# EAGLE design controllerHatMini (EAGLE 7.6.0)
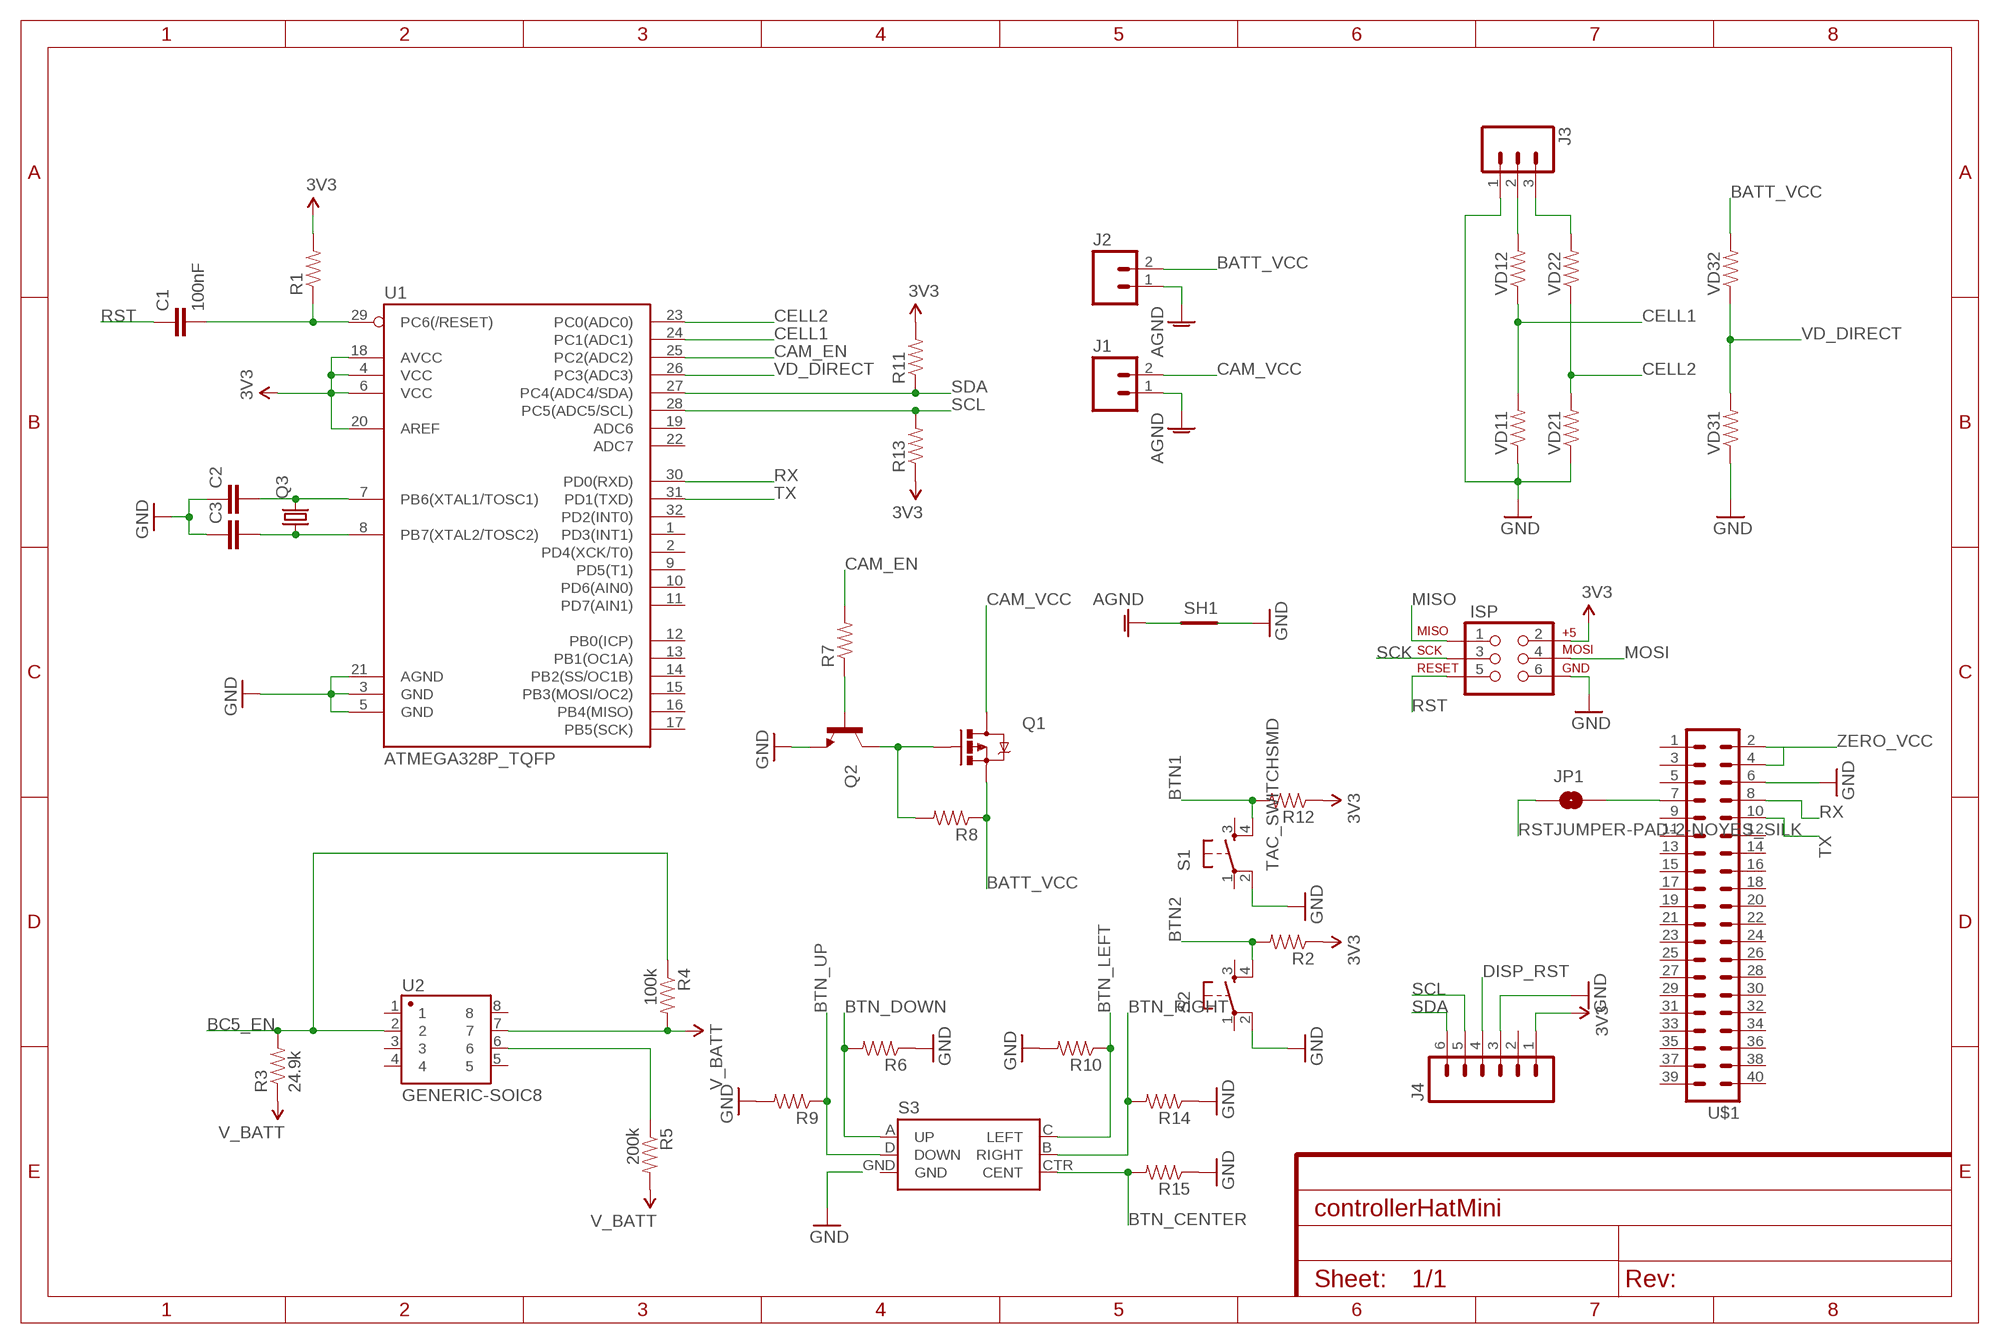
[diagram p0: schematic, sheet 1]

## Parts
C1  100nF  CAP1206  [1206]
C2  CAP1206  [1206]
C3  CAP1206  [1206]
ISP  AVR_SPI_PRG_6PTH  [2X3]
J1  M023.5MM_LOCK  [SCREWTERMINAL-3.5MM-2_LOCK]
J2  M023.5MM_LOCK  [SCREWTERMINAL-3.5MM-2_LOCK]
J3  M03LOCK  [1X03_LOCK]
J4  M06LOCK  [1X06_LOCK]
JP1  JUMPER-PAD-2-NOYES_SILK  [PAD-JUMPER-2-NO_YES_SILK]
Q1  MOSFET-PCHANNELNDP6020P_20V_24A_LOW_VGS_TH  [TO220V]
Q2  TRANSISTOR_NPN2N3904  [TO-92]
Q3  CRYSTALMM20SS  [MM20SS]
R1  RESISTOR1206  [1206]
R2  RESISTOR1206  [1206]
R3  24.9k  RESISTOR1206  [1206]
R4  100k  RESISTOR1206  [1206]
R5  200k  RESISTOR1206  [1206]
R6  RESISTOR1206  [1206]
R7  RESISTOR1206  [1206]
R8  RESISTOR1206  [1206]
R9  RESISTOR1206  [1206]
R10  RESISTOR1206  [1206]
R11  RESISTOR1206  [1206]
R12  RESISTOR1206  [1206]
R13  RESISTOR1206  [1206]
R14  RESISTOR1206  [1206]
R15  RESISTOR1206  [1206]
S1  TAC_SWITCHSMD  TAC_SWITCHPTH  [TACTILE-PTH]
S2  TAC_SWITCHPTH  [TACTILE-PTH]
S3  JOYSTICK_MINI  [JOYSTICK_MINI]
SH1  SHORT-HT5  [SHORT_TOP-50]
U1  ATMEGA328P_TQFP  [TQFP32-08]
U2  GENERIC-SOIC8  [SO08-UNIVERSAL]
U$1  PIZERO_THROUGH_HOLE  [PIZERO_THOUGH_HOLE]
VD11  RESISTOR1206  [1206]
VD12  RESISTOR1206  [1206]
VD21  RESISTOR1206  [1206]
VD22  RESISTOR1206  [1206]
VD31  RESISTOR1206  [1206]
VD32  RESISTOR1206  [1206]

## Nets
AGND [power]: J1.1 J2.1 SH1.1
BATT_VCC [power]: J2.2 Q1.3(S) R8.1 VD32.2
BC5_EN: R3.2 R4.1 U2.2
BTN1: R12.2 S1.4
BTN2: R2.2 S2.4
BTN_CENTER: R15.2 S3.CTR(CENT)
BTN_DOWN: R6.2 S3.A(UP)
BTN_LEFT: R10.1 S3.C(LEFT)
BTN_RIGHT: R14.2 S3.B(RIGHT)
BTN_UP: R9.1 S3.D(DOWN)
CAM_EN: R7.2 U1.25(PC2(ADC2))
CAM_VCC [power]: J1.2 Q1.2(D)
CELL1: U1.24(PC1(ADC1)) VD11.2 VD12.1
CELL2: U1.23(PC0(ADC0)) VD21.2 VD22.1
DISP_RST [power]: J4.4
GND: C2.1 C3.1 ISP.6 J3.1 J4.3 Q2.1(E) R6.1 R9.2 R10.2 R14.1 R15.1 S1.2 S2.2 SH1.2 U1.3(GND) U1.5(GND) U1.21(AGND) U$1.6 VD11.1 VD21.1 VD31.1
MISO: ISP.1
MOSI: ISP.4
N$1: J3.3 VD22.2
N$2: J3.2 VD12.2
N$3: C1.2 R1.1 U1.29(PC6(/RESET))
N$4: U$1.4
N$5: Q2.2(B) R7.1
N$6: C3.2 Q3.1 U1.8(PB7(XTAL2/TOSC2))
N$7: C2.2 Q3.4 U1.7(PB6(XTAL1/TOSC1))
N$8: JP1.2 U$1.7
N$9: Q1.1(G) Q2.3(C) R8.2
N$11: R5.1 U2.6
RST: C1.1 ISP.5 JP1.1
RX: U1.30(PD0(RXD)) U$1.8
SCK: ISP.3
SCL: J4.5 R13.2 U1.28(PC5(ADC5/SCL))
SDA: J4.6 R11.1 U1.27(PC4(ADC4/SDA))
TX: U1.31(PD1(TXD)) U$1.10
V_BATT: R3.1 R4.2 R5.2 U2.7
VCC: ISP.2 J4.1 R1.2 R2.1 R11.2 R12.1 R13.1 U1.4(VCC) U1.6(VCC) U1.18(AVCC) U1.20(AREF) ; supply symbol labelled 3V3
VD_DIRECT: U1.26(PC3(ADC3)) VD31.2 VD32.1
ZERO_VCC: U$1.2
Unconnected: J4.2 S1.1 S1.3 S2.1 S2.3 S3.GND U1.1(PD3(INT1)) U1.2(PD4(XCK/T0)) U1.9(PD5(T1)) U1.10(PD6(AIN0)) U1.11(PD7(AIN1)) U1.12(PB0(ICP)) U1.13(PB1(OC1A)) U1.14(PB2(SS/OC1B)) U1.15(PB3(MOSI/OC2)) U1.16(PB4(MISO)) U1.17(PB5(SCK)) U1.19(ADC6) U1.22(ADC7) U1.32(PD2(INT0)) U2.1 U2.3 U2.4 U2.5 U2.8 U$1.1 U$1.3 U$1.5 U$1.9 U$1.11 U$1.12 U$1.13 U$1.14 U$1.15 U$1.16 U$1.17 U$1.18 U$1.19 U$1.20 U$1.21 U$1.22 U$1.23 U$1.24 U$1.25 U$1.26 U$1.27 U$1.28 U$1.29 U$1.30 U$1.31 U$1.32 U$1.33 U$1.34 U$1.35 U$1.36 U$1.37 U$1.38 U$1.39 U$1.40

## Library data of the parts
C1-C3 = SparkFun-Capacitors:CAP: Capacitor Standard 0603 ceramic capacitor, and 0.1" leaded capacitor.
ISP = SparkFun-Connectors:AVR_SPI_PRG_6: AVR ISP 6 Pin This is the reduced ISP connector for AVR programming. Common on Arduino. This footprint will take up less PCB space and can be used with a 10-pin to 6-pin adapter such as SKU: BOB-08508 **Special note about "TEST_POINT" package. The stop mask is on the top side, so if you want your programming test points to be on the bottom of your board, make sure to place this package on the bottom side of the board. This also ensure that the orientation to program from the bottom side will be correct.
J1 J2 = SparkFun-Connectors:M02: Standard 2-pin 0.1" header. Use with - straight break away headers ( PRT-00116) - right angle break away headers (PRT-00553) - swiss pins (PRT-00743) - machine pins (PRT-00117) - female headers (PRT-00115) Molex polarized connector foot print use with: PRT-08233 with associated crimp pins and housings. 2.54_SCREWTERM for use with PRT-10571. 3.5mm Screw Terminal footprints for PRT-08084 5mm Screw Terminal footprints for use with PRT-08432; PROD_ID: CONN-08399
J3 = SparkFun-Connectors:M03: Header 3 Standard 3-pin 0.1" header. Use with straight break away headers (SKU : PRT-00116), right angle break away headers (PRT-00553), swiss pins (PRT-00743), machine pins (PRT-00117), and female headers (PRT-00115). Molex polarized connector foot print use with SKU : PRT-08232 with associated crimp pins and housings.
J4 = SparkFun-Connectors:M06: Header 6 Standard 6-pin 0.1" header. Use with straight break away headers (SKU : PRT-00116), right angle break away headers (PRT-00553), swiss pins (PRT-00743), machine pins (PRT-00117), and female headers (PRT-00115). Molex polarized connector foot print use with SKU : PRT-08094 with associated crimp pins and housings. NOTES ON THE VARIANTS LOCK and LOCK_LONGPADS... This footprint was designed to help hold the alignment of a through-hole component (i.e. 6-pin header) while soldering it into place. You may notice that each hole has been shifted either up or down by 0.005 of an inch from it's more standard position (which is a perfectly straight line). This slight alteration caused the pins (the squares in the middle) to touch the edges of the holes. Because they are alternating, it causes a "brace" to hold the component in place. 0.005 has proven to be the perfect amount of "off-center" position when using our standard breakaway headers. Although looks a little odd when you look at the bare footprint, once you have a header in there, the alteration is very hard to notice. Also,if you push a header all the way into place, it is covered up entirely on the bottom side. This idea of altering the position of holes to aid alignment will be further integrated into the Sparkfun Library for other footprints. It can help hold any component with 3 or more connection pins.
JP1 = SparkFun-Passives:JUMPER-PAD-2-NO
Q1 = SparkFun-DiscreteSemi:MOSFET-PCHANNEL: Generic PMOSFET IRLML2244 - TRANS-11153 (SOT-23 -20V -4.3A) (1.Gate 2.Source 3.Drain) FQP27P06 - COM-10349 <http://www.sparkfun.com/products/10349> (TO-220 -60V -27A) (1.Gate 2.Source 3.Drain); PROD_ID: TRANS-13060
Q2 = SparkFun-DiscreteSemi:TRANSISTOR_NPN: Generic NPN BJT MMBT2222A - TRANS-08049 (SOT-23, 1A 40V) MPSA42 - TRANS-09116 (SOT-23, 500mA 300V) MMBT5088LT1G - TRANS-11160 (SOT-23, 50 mA 30V) BC547 - COM-08928 <http://www.sparkfun.com/products/8928> (TO-92 45V 100mA) (1.Collector 2.Base 3.Emitter) 2N3904 - COM-00521 <http://www.sparkfun.com/products/521> (TO-92 40V 200mA) (1.Emitter 2.Base 3.Collector) P2N2222A - COM-12852 <http://www.sparkfun.com/products/12852> (TO-92 40V 600mA) (1.Collector 2.Base 3.Emitter); PROD_ID: TRANS-08447
Q3 = adafruit:CRYSTAL: CRYSTAL; OC_FARNELL: unknown; OC_NEWARK: unknown
R1-R15 VD11 VD12 VD21 VD22 VD31 VD32 = SparkFun-Passives:RESISTOR: Resistor Basic schematic elements and footprints for 0603, 1206, and PTH resistors.
S1 S2 = SparkFun-Retired:TAC_SWITCH: Momentary Switch Button commonly used for reset or general input. Spark Fun Electronics SKU : COM-00097 SMT- SWCH-08247
S3 = SparkFun-Electromechanical:JOYSTICK_MINI: Small 5-way tactile joystick, COM-10063 4UCON SF303GJ26; PROD_ID: SWCH-09905
SH1 = shorts-old:SHORT-H: Short between two nets; BOM: no
U1 = SparkFun-DigitalIC:ATMEGA328P_TQFP; PROD_ID: IC-09069
U2 = SparkFun-AnalogIC:GENERIC-SOIC8: A placeholder for generic narrow & wide SOIC8 foorptints - used on the DIP adapter board.
U$1 = pizero:PIZERO_THROUGH_HOLE

## Net classes
1 power: width 0.762 mm

## Board
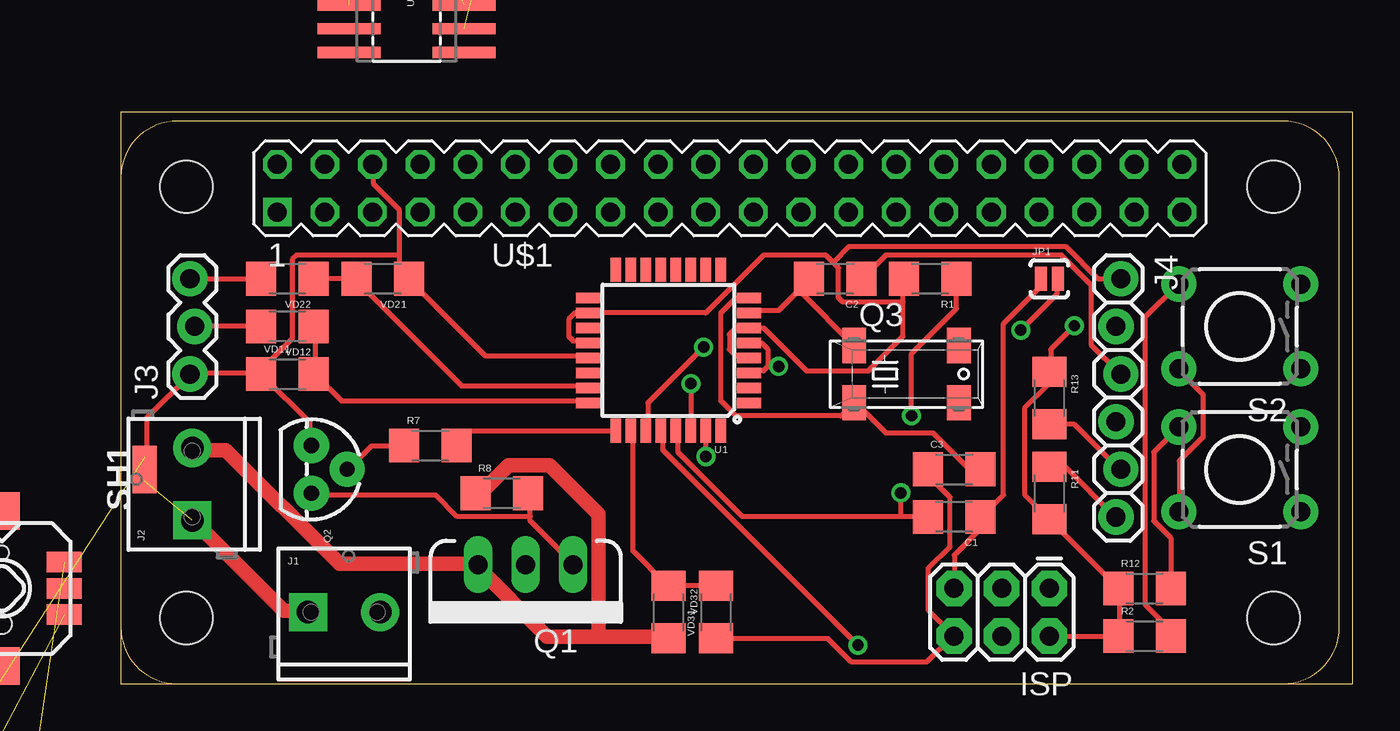
[diagram p1: board, top side]
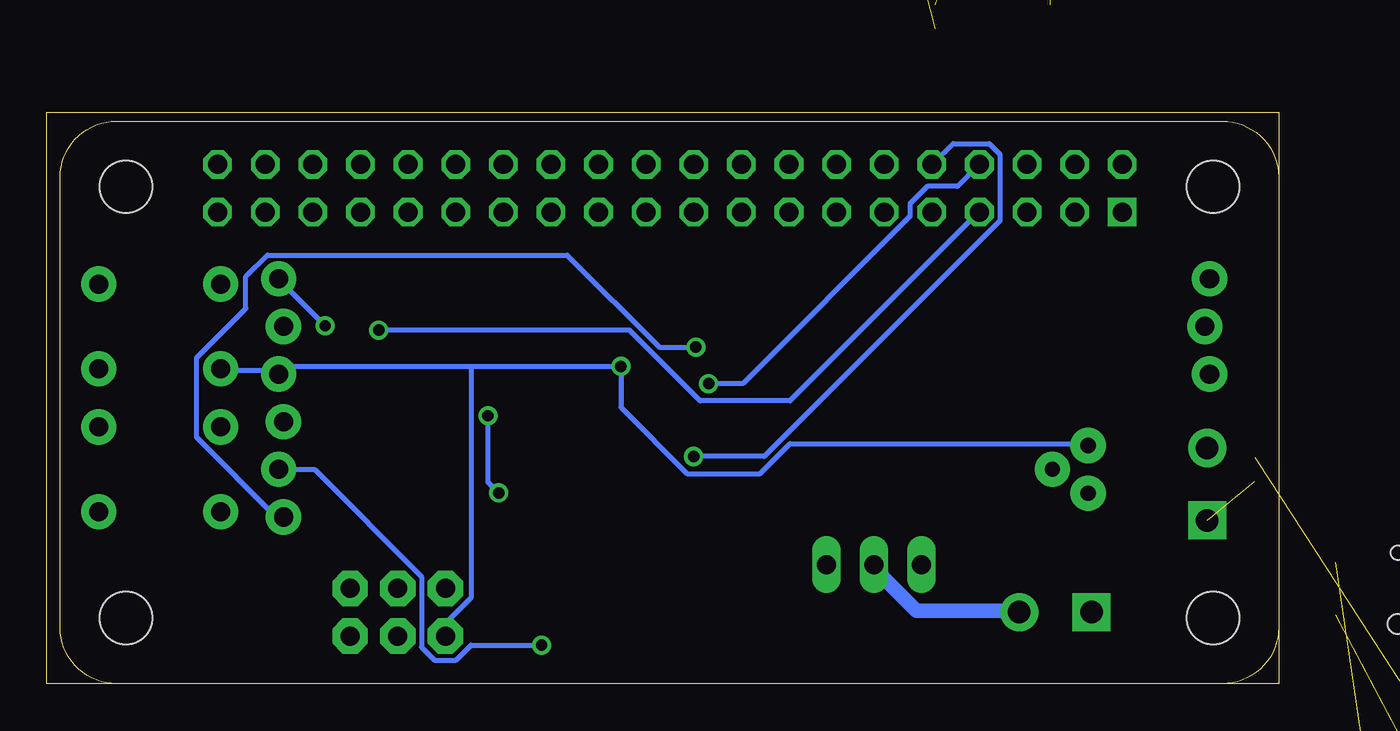
[diagram p2: board, bottom side, seen from below]

Size 65.71 x 30.47 mm. Coordinates in mm from the lower left corner, seen from the top.
Outline: 0,0 65.71,0 65.71,30.47 0,30.47 0,0
Copper layers (1*16): Top 0.035mm / dielectric 1.5mm / Bottom 0.035mm
Design rules "default": minimum track width 10mil, minimum drill 24mil, track to track 8mil, track to pad 8mil, pad to pad 8mil, via to via 8mil, smd to smd 8mil, copper to edge 40mil, drill to drill 8mil, minimum pad ring 10mil, minimum via ring 8mil, stop-mask expansion 4mil, vias tented up to drill 0mil, thermal gap 10mil

### Footprints (pad centres in the part's own frame; a part is rotated, then mirrored left to right if it is on the bottom)
1206 = smd 1.6 x 1.8: 1 -1.4,0; 2 1.4,0
2X3 = drill 1.016 pad 1.88 octagon: 1 0,0; 2 0,2.54; 3 2.54,0; 4 2.54,2.54; 5 5.08,0; 6 5.08,2.54
SCREWTERMINAL-3.5MM-2_LOCK = drill 1.2 pad 2.032 square: 1 -0.178,0 | drill 1.2 pad 2.032: 2 3.678,0
1X03_LOCK = drill 1.016 pad 1.88: 1 0,0.127; 2 2.54,-0.127; 3 5.08,0.127
1X06_LOCK = drill 1.016 pad 1.88: 1 0,0; 2 2.54,-0.254; 3 5.08,0; 4 7.62,-0.254; 5 10.16,0; 6 12.7,-0.254
PAD-JUMPER-2-NO_YES_SILK = smd 0.635 x 1.27: 1 -0.45,0; 2 0.45,0
TO220V = drill 1.016 long: 1 -2.54,0; 2 0,0; 3 2.54,0
TO-92 = drill 0.813 pad 1.88: 1 -1.27,0; 2 0,1.905; 3 1.27,0
MM20SS = smd 1.27 x 1.88: 1 -2.794,-1.524; 2 2.794,-1.524; 3 2.794,1.524; 4 -2.794,1.524
TACTILE-PTH = drill 1.016 pad 1.88: 1 -3.251,2.261; 2 3.251,2.261; 3 -3.251,-2.261; 4 3.251,-2.261
JOYSTICK_MINI = smd 1.85 x 1.1: A -3.325,1.4; B 3.325,1.4; C -3.325,-1.4; CTR -3.325,0; D 3.325,-1.4; GND 3.325,0 | smd 1.9 x 2: NC 0,4.13; NC@0 0,-4.13 | hole 0.75: 0,1.9 | hole 1.05: 0,-1.9
SHORT_TOP-50 = smd 1.27 x 1.27: 1 0.635,0; 2 -0.635,0
TQFP32-08 = smd 1.27 x 0.559: 1 -4.293,2.8; 2 -4.293,2; 3 -4.293,1.2; 4 -4.293,0.4; 5 -4.293,-0.4; 6 -4.293,-1.2; 7 -4.293,-2; 8 -4.293,-2.8; 17 4.293,-2.8; 18 4.293,-2; 19 4.293,-1.2; 20 4.293,-0.4; 21 4.293,0.4; 22 4.293,1.2; 23 4.293,2; 24 4.293,2.8 | smd 0.559 x 1.27: 9 -2.8,-4.293; 10 -2,-4.293; 11 -1.2,-4.293; 12 -0.4,-4.293; 13 0.4,-4.293; 14 1.2,-4.293; 15 2,-4.293; 16 2.8,-4.293; 25 2.8,4.293; 26 2,4.293; 27 1.2,4.293; 28 0.4,4.293; 29 -0.4,4.293; 30 -1.2,4.293; 31 -2,4.293; 32 -2.8,4.293
SO08-UNIVERSAL = smd 0.61 x 3.353: 1 -1.905,-3.073; 2 -0.635,-3.073; 3 0.635,-3.073; 4 1.905,-3.073; 5 1.905,3.073; 6 0.635,3.073; 7 -0.635,3.073; 8 -1.905,3.073
PIZERO_THOUGH_HOLE = drill 1.016 square: 1 8.34,25.15 | drill 1.016 octagon: 2 8.34,27.69; 3 10.88,25.15; 4 10.88,27.69; 5 13.42,25.15; 6 13.42,27.69; 7 15.96,25.15; 8 15.96,27.69; 9 18.5,25.15; 10 18.5,27.69; 11 21.04,25.15; 12 21.04,27.69; 13 23.58,25.15; 14 23.58,27.69; 15 26.12,25.15; 16 26.12,27.69; 17 28.66,25.15; 18 28.66,27.69; 19 31.2,25.15; 20 31.2,27.69; 21 33.74,25.15; 22 33.74,27.69; 23 36.28,25.15; 24 36.28,27.69; 25 38.82,25.15; 26 38.82,27.69; 27 41.36,25.15; 28 41.36,27.69; 29 43.9,25.15; 30 43.9,27.69; 31 46.44,25.15; 32 46.44,27.69; 33 48.98,25.15; 34 48.98,27.69; 35 51.52,25.15; 36 51.52,27.69; 37 54.06,25.15; 38 54.06,27.69; 39 56.6,25.15; 40 56.6,27.69 | hole 2.8: 3.5,3.5; 3.5,26.5; 61.5,26.5; 61.5,3.5

### Placement (x,y rotation side)
C1  44.45,8.89 180 top
C2  38.1,21.59 180 top
C3  44.45,11.43 0 top
ISP  49.53,5.08 180 top
J1  10.16,3.81 0 top
J2  3.81,8.89 90 top
J3  3.81,16.51 90 top
J4  53.34,21.59 270 top
JP1  49.53,21.59 0 top
Q1  21.59,6.35 180 top
Q2  10.16,11.43 270 top
Q3  41.91,16.51 0 top
R1  43.18,21.59 180 top
R2  54.61,2.54 0 top
R3  13.97,44.45 180 top  (outside the outline)
R4  13.97,48.26 0 top  (outside the outline)
R5  20.32,48.26 180 top  (outside the outline)
R6  -7.62,-3.81 0 top  (outside the outline)
R7  16.51,12.7 0 top
R8  20.32,10.16 0 top
R9  -7.62,-7.62 0 top  (outside the outline)
R10  -7.62,-11.43 0 top  (outside the outline)
R11  49.53,10.16 270 top
R12  54.61,5.08 0 top
R13  49.53,15.24 270 top
R14  -7.62,-15.24 0 top  (outside the outline)
R15  -7.62,-19.05 0 top  (outside the outline)
S1  59.69,11.43 180 top
S2  59.69,19.05 180 top
S3  -6.35,5.08 0 top  (outside the outline)
SH1  1.27,11.43 270 top
U1  29.21,17.78 180 top
U2  15.24,35.56 270 top  (outside the outline)
U$1  0,0 0 top
VD11  8.89,16.51 0 top
VD12  8.89,19.05 180 top
VD21  13.97,21.59 180 top
VD22  8.89,21.59 180 top
VD31  31.75,3.81 90 top
VD32  29.21,3.81 270 top

### Tracks (layer width: path | path; a pad name or v marks a point on that pad's centre or on a via)
AGND  (1 unrouted)
  Top 0.762: J1.1 9.94,3.89 8.69,3.89 3.89,8.69 J2.1
BATT_VCC
  Top 0.762: 25.49,2.52 22.75,2.52 18.97,6.29 Q1.3 18.63,6.4 11.66,6.4 5.6,12.46 3.89,12.46 J2.2 | 25.49,2.52 29.15,2.52 VD32.2 | 25.49,2.52 25.49,9.03 22.86,11.66 20.69,11.66 19.2,10.17 18.97,10.17 R8.1
BC5_EN  (2 unrouted)
BTN1
  Top 0.254: S1.4 55.09,12.34 55.09,8.69 56.01,7.77 56.01,5.14 R12.2
BTN2
  Top 0.254: R2.2 56.01,2.63 56.01,2.86 54.63,4.23 54.63,19.55 56.35,21.26 S2.4
BTN_CENTER  (1 unrouted)
BTN_DOWN  (1 unrouted)
BTN_LEFT  (1 unrouted)
BTN_RIGHT  (1 unrouted)
BTN_UP  (1 unrouted)
CAM_EN
  Top 0.254: U1.25 18.63,13.49 17.95,12.8 R7.2
CAM_VCC
  Bottom 0.762: Q1.2 21.49,6.29 21.49,6.06 19.32,3.89 13.95,3.89 J1.2
CELL1
  Top 0.254: U1.24 24.92,15.09 11.77,15.09 10.4,16.46 VD11.2 10.4,16.57 10.4,18.97 VD12.1
CELL2
  Top 0.254: U1.23 24.92,15.89 18.17,15.89 12.57,21.49 VD21.2 12.46,21.6 10.4,21.6 VD22.1
GND  (via drill 0.61)  (5 unrouted)
  Top 0.254: SH1.2 1.37,12.12 1.37,14.17 3.66,16.46 J3.1 3.77,16.57 7.43,16.57 VD11.1 | Q2.1 10.06,12.8 10.06,13.95 7.54,16.46 VD11.1 | U1.21 24.92,17.49 19.43,17.49 15.43,21.49 VD21.1 15.32,21.6 14.86,22.06 14.86,22.86 | 14.86,22.86 14.86,25.26 13.49,26.63 13.49,27.66 U$1.6 | 14.86,22.86 9.37,22.86 9.14,22.63 9.14,18.4 7.43,16.69 VD11.1 | VD31.1 31.77,2.4 37.72,2.4 38.98,1.14 42.98,1.14 44.35,2.52 ISP.6 44.35,2.63 43.09,3.89 43.09,6.17 44.23,7.32 44.23,9.94 43.09,11.09 43.09,11.43 C3.1 | S1.2 56.46,9.26 56.46,11.89 57.72,13.14 57.72,15.43 56.46,16.69 S2.2 | 34.52,16.92 34.29,16.69 33.6,16.69 U1.3 | 34.52,16.92 34.52,17.83 34.18,18.17 33.6,18.17 U1.5 | C2.1 39.55,21.6 40.8,22.86 50.18,22.86 51.78,21.26 51.78,18.06 53.26,16.57 J4.3 | v35.09,16.92 34.52,16.92
  Bottom 0.254: 43.09,16.92 52.92,16.92 53.26,16.57 J4.3 53.26,16.69 56.35,16.69 S2.2 | 43.09,16.92 v35.09,16.92 35.09,14.74 31.55,11.2 27.66,11.2 26.06,12.8 10.17,12.8 Q2.1 | 43.09,16.92 43.09,4.57 44.35,3.31 44.35,2.63 ISP.6
N$1
  Top 0.254: VD22.2 7.43,21.6 3.77,21.6 J3.3
N$2
  Top 0.254: VD12.2 7.43,19.09 4,19.09 J3.2
N$3  (via drill 0.61)
  Top 0.254: 41.6,8.91 42.98,8.91 C1.2 | 41.6,8.91 33.15,8.91 29.72,12.34 29.72,13.49 U1.29 | v42.18,14.29 42.18,17.6 44.58,20 44.58,21.49 R1.1 | 41.6,8.91 v41.6,10.17
  Bottom 0.254: v42.18,14.29 42.18,10.74 v41.6,10.17
N$5
  Top 0.254: R7.1 15.09,12.69 13.37,12.69 12.12,11.43 Q2.2
N$6
  Top 0.254: U1.8 32.8,20.57 32,19.77 32,15.09 32.8,14.29 38.41,14.29 39.09,14.97 Q3.1 39.2,14.97 40.8,13.37 43.32,13.37 45.26,11.43 C3.2
N$7
  Top 0.254: U1.7 33.6,19.89 35.09,19.89 36.69,21.49 C2.2 36.23,20.92 Q3.4
N$8  (via drill 0.61)
  Top 0.254: v48.01,18.86 49.95,20.8 49.95,21.49 JP1.2
  Bottom 0.254: v48.01,18.86 34.63,18.86 30.86,15.09 26.06,15.09 16,25.15 U$1.7
N$9
  Top 0.254: 21.83,8.91 21.83,8.69 24.12,6.4 Q1.1 | 21.83,8.91 21.83,10.06 R8.2 | 21.83,8.91 17.95,8.91 16.8,10.06 10.17,10.06 Q2.3
N$11  (1 unrouted)
RST
  Top 0.254: JP1.1 49.03,21.49 49.03,21.14 47.09,19.2 47.09,10.06 45.95,8.91 C1.1 45.83,8.8 45.83,8.23 44.46,6.86 44.46,5.14 ISP.5
RX  (via drill 0.61)
  Top 0.254: v30.4,16 U1.30
  Bottom 0.254: v30.4,16 28.57,16 19.66,24.92 19.66,25.6 18.75,26.52 17.14,26.52 16,27.66 U$1.8
SCL  (via drill 0.61)
  Top 0.254: v39.32,2.06 28.92,12.46 28.92,13.49 U1.28 | R13.2 49.61,13.83 50.86,13.83 53.26,11.43 J4.5
  Bottom 0.254: v39.32,2.06 43.09,2.06 43.89,1.26 45.03,1.26 45.72,1.94 45.72,5.71 51.44,11.43 J4.5
SDA  (via drill 0.61)
  Top 0.254: v31.09,17.95 28.12,14.97 28.12,13.49 U1.27 | R11.1 49.61,11.54 50.41,11.54 53.03,8.91 J4.6
  Bottom 0.254: v31.09,17.95 33.03,17.95 37.95,22.86 53.95,22.86 55.09,21.72 55.09,20 57.72,17.37 57.72,13.14 53.49,8.91 53.15,8.91 J4.6
TX  (via drill 0.61)
  Top 0.254: v31.2,12.12 U1.31
  Bottom 0.254: v31.2,12.12 27.43,12.12 14.86,24.69 14.86,28.23 15.43,28.8 17.37,28.8 18.4,27.77 U$1.10
V_BATT  (3 unrouted)
VCC  (via drill 0.61)
  Top 0.254: ISP.2 49.61,2.52 53.15,2.52 R2.1 53.26,2.63 53.26,5.03 R12.1 53.15,5.14 49.61,8.69 R11.2 49.49,8.8 48.23,10.06 48.23,14.74 49.49,16 49.49,16.57 R13.1 49.61,16.69 49.61,17.83 v50.86,19.09 | U1.20 24.92,18.29 24.12,18.29 23.89,18.52 23.89,19.43 24.23,19.77 U1.18 25.03,19.77 31.2,19.77 34.29,22.86 37.6,22.86 38.01,22.46 | U1.4 33.49,17.49 32.8,17.49 32.46,17.83 32.46,18.63 32.8,18.97 U1.6 33.6,18.97 34.29,18.97 36.58,16.69 39.89,16.69 41.72,18.52 41.72,20.34 | 41.72,20.34 41.72,21.49 R1.2 | 38.01,22.46 38.29,22.17 38.29,20.57 38.52,20.34 41.72,20.34 | 38.01,22.46 38.86,23.32 50.41,23.32 52.12,21.6 53.26,21.6 J4.1
  Bottom 0.254: v50.86,19.09 53.26,21.49 J4.1
VD_DIRECT
  Top 0.254: U1.26 27.32,13.49 27.32,7.09 29.15,5.26 VD32.1 29.26,5.26 31.66,5.26 VD31.2